# Altium schematic sheet Controller.SchDoc
size A4; SheetNumber: 2; SheetTotal: 5
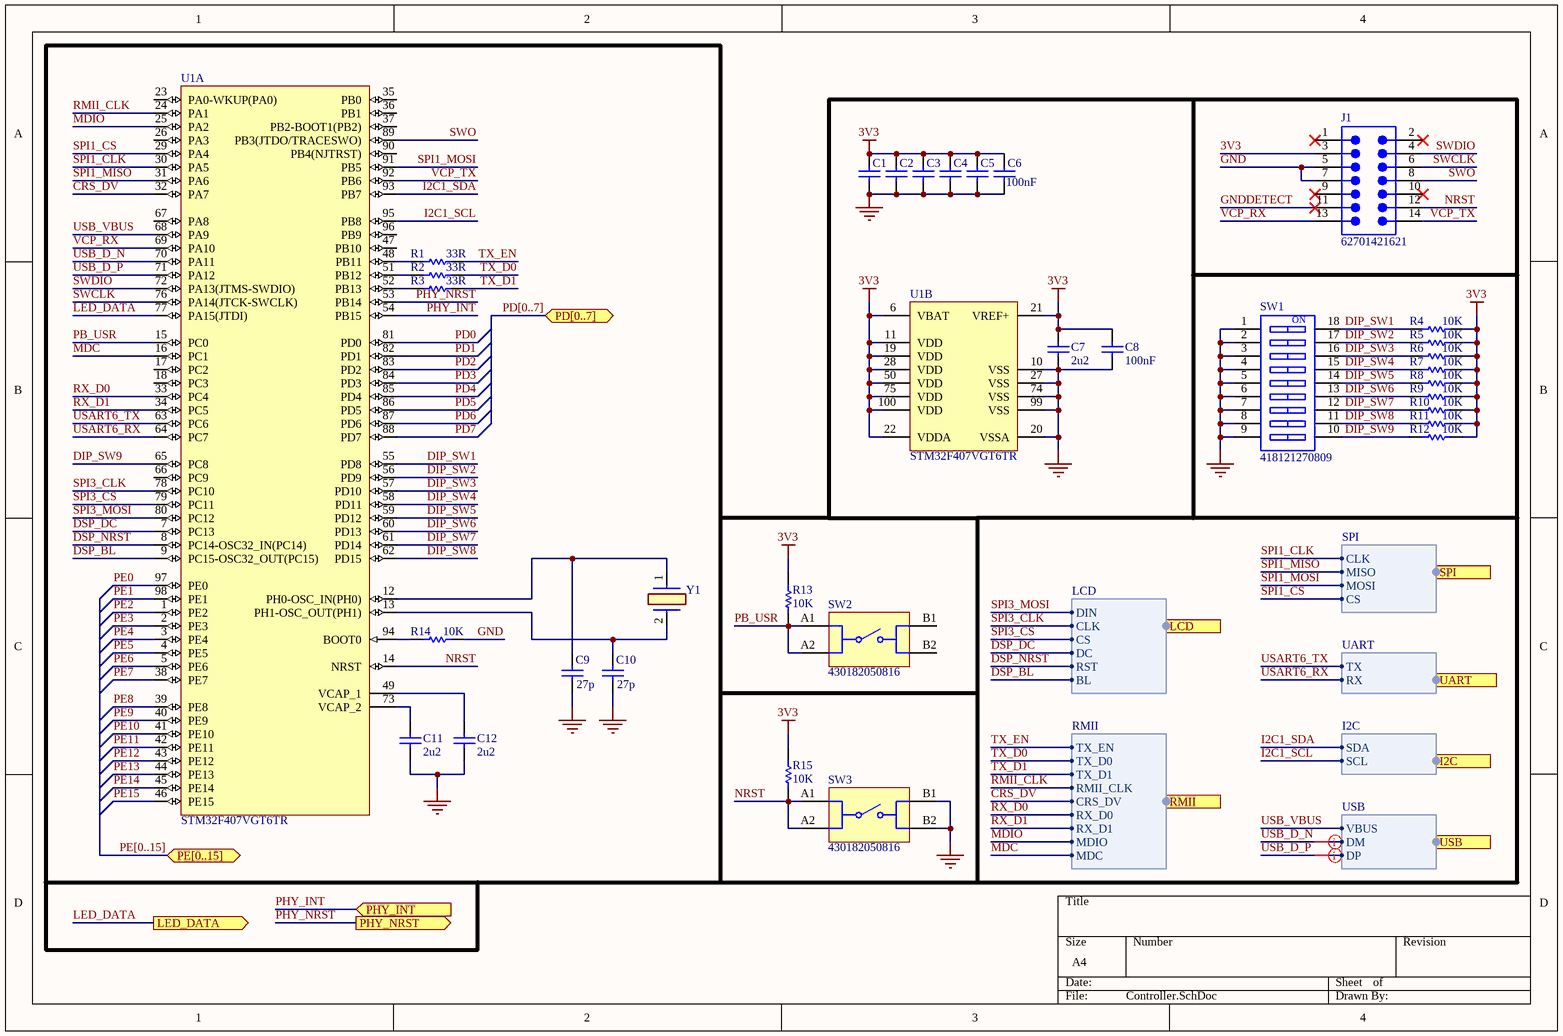
[diagram p0: Controller.SchDoc]

## Parts
C1  100nF  [0603]  (value not drawn)
C2  100nF  [0603]  (value not drawn)
C3  100nF  [0603]  (value not drawn)
C4  100nF  [0603]  (value not drawn)
C5  100nF  [0603]  (value not drawn)
C6  100nF  [0603]
C7  2u2  [1206]
C8  100nF  [0603]
C9  27p  [0603]
C10  27p  [0603]
C11  2u2  [1206]
C12  2u2  [1206]
J1  62701421621  [62701421621]
R1  33R  [0603]
R2  33R  [0603]
R3  33R  [0603]
R4  10K  [0603]
R5  10K  [0603]
R6  10K  [0603]
R7  10K  [0603]
R8  10K  [0603]
R9  10K  [0603]
R10  10K  [0603]
R11  10K  [0603]
R12  10K  [0603]
R13  10K  [0603]
R14  10K  [0603]
R15  10K  [0603]
SW1  418121270809  [418121270809]
SW2  430182050816  [430182050816]
SW3  430182050816  [430182050816]
U1  STM32F407VGT6TR  [STM-LQFP100_V]  (parts A,B of 2)
Y1  ABLS7M-16.000MHZ-B-2-T  [ABLS7]  (value not drawn)

## Ports
I2C (harness I2c, see Main[2B], Periph[4D]), LCD (harness LCD, see Main[2B], Periph[3C]), LED_DATA (out, see Main[2A], Periph[1A]), PD[0..7] (bidir, see Main[2B], Periph[3B]), PE[0..15] (bidir, see Main[2B], Periph[4B]), PHY_INT (in, see Main[2A], Ethernet[1C]), PHY_NRST (out, see Main[2B], Ethernet[1D]), RMII (harness RMII, see Main[2A], Ethernet[1B]), SPI (harness SPI, see Main[2B], Periph[3D]), UART (harness UART, see Main[2B], Periph[4D]), USB (harness USB, see Main[2A], Power[4D])

## Harnesses
RMII: TX_EN, TX_D0, TX_D1, RMII_CLK, CRS_DV, RX_D0, RX_D1, MDIO, MDC
USB: VBUS, DM, DP
I2C: SDA, SCL
UART: TX, RX
SPI: CLK, MISO, MOSI, CS
LCD: DIN, CLK, CS, DC, RST, BL

## Nets
3V3: C1.2 C2.2 C3.2 C4.2 C5.2 C6.2 C7.2 C8.2 J1.3 R4.2 R5.2 R6.2 R7.2 R8.2 R9.2 R10.2 R11.2 R12.2 R13.2 R15.2 U1.6(VBAT) U1.11(VDD) U1.19(VDD) U1.21(VREF+) U1.22(VDDA) U1.28(VDD) U1.50(VDD) U1.75(VDD) U1.100(VDD)
GND: C1.1 C2.1 C3.1 C4.1 C5.1 C6.1 C7.1 C8.1 C9.1 C10.1 C11.1 C12.1 J1.5 J1.7 R14.2 SW1.1 SW1.2 SW1.3 SW1.4 SW1.5 SW1.6 SW1.7 SW1.8 SW1.9 SW3.B1 SW3.B2 U1.10(VSS) U1.20(VSSA) U1.27(VSS) U1.74(VSS) U1.99(VSS)
CRS_DV: U1.32(PA7) ; port RMII.CRS_DV
DIP_SW1: R4.1 SW1.18 U1.55(PD8)
DIP_SW2: R5.1 SW1.17 U1.56(PD9)
DIP_SW3: R6.1 SW1.16 U1.57(PD10)
DIP_SW4: R7.1 SW1.15 U1.58(PD11)
DIP_SW5: R8.1 SW1.14 U1.59(PD12)
DIP_SW6: R9.1 SW1.13 U1.60(PD13)
DIP_SW7: R10.1 SW1.12 U1.61(PD14)
DIP_SW8: R11.1 SW1.11 U1.62(PD15)
DIP_SW9: R12.1 SW1.10 U1.65(PC8)
DSP_BL: U1.9(PC15-OSC32_OUT(PC15)) ; port LCD.BL
DSP_DC: U1.7(PC13) ; port LCD.DC
DSP_NRST: U1.8(PC14-OSC32_IN(PC14)) ; port LCD.RST
GNDDETECT: J1.11
I2C1_SCL: U1.95(PB8) ; port I2C.SCL
I2C1_SDA: U1.93(PB7) ; port I2C.SDA
LED_DATA: U1.77(PA15(JTDI)) ; port LED_DATA
MDC: U1.16(PC1) ; port RMII.MDC
MDIO: U1.25(PA2) ; port RMII.MDIO
NRST: J1.12 R15.1 SW3.A1 SW3.A2 U1.14(NRST)
PB_USR: R13.1 SW2.A1 SW2.A2 U1.15(PC0)
PD0: U1.81(PD0)
PD1: U1.82(PD1)
PD2: U1.83(PD2)
PD3: U1.84(PD3)
PD4: U1.85(PD4)
PD5: U1.86(PD5)
PD6: U1.87(PD6)
PD7: U1.88(PD7)
PE0: U1.97(PE0)
PE1: U1.98(PE1)
PE2: U1.1(PE2)
PE3: U1.2(PE3)
PE4: U1.3(PE4)
PE5: U1.4(PE5)
PE6: U1.5(PE6)
PE7: U1.38(PE7)
PE8: U1.39(PE8)
PE9: U1.40(PE9)
PE10: U1.41(PE10)
PE11: U1.42(PE11)
PE12: U1.43(PE12)
PE13: U1.44(PE13)
PE14: U1.45(PE14)
PE15: U1.46(PE15)
PHY_INT: U1.54(PB15) ; port PHY_INT
PHY_NRST: U1.53(PB14) ; port PHY_NRST
RMII_CLK: U1.24(PA1) ; port RMII.RMII_CLK
RX_D0: U1.33(PC4) ; port RMII.RX_D0
RX_D1: U1.34(PC5) ; port RMII.RX_D1
SPI1_CLK: U1.30(PA5) ; port SPI.CLK
SPI1_CS: U1.29(PA4) ; port SPI.CS
SPI1_MISO: U1.31(PA6) ; port SPI.MISO
SPI1_MOSI: U1.91(PB5) ; port SPI.MOSI
SPI3_CLK: U1.78(PC10) ; port LCD.CLK
SPI3_CS: U1.79(PC11) ; port LCD.CS
SPI3_MOSI: U1.80(PC12) ; port LCD.DIN
SWCLK: J1.6 U1.76(PA14(JTCK-SWCLK))
SWDIO: J1.4 U1.72(PA13(JTMS-SWDIO))
SWO: J1.8 U1.89(PB3(JTDO/TRACESWO))
TX_D0: R2.2 ; port RMII.TX_D0
TX_D1: R3.2 ; port RMII.TX_D1
TX_EN: R1.2 ; port RMII.TX_EN
USART6_RX: U1.64(PC7) ; port UART.RX
USART6_TX: U1.63(PC6) ; port UART.TX
USB_D_N: U1.70(PA11) ; port USB.DM
USB_D_P: U1.71(PA12) ; port USB.DP
USB_VBUS: U1.68(PA9) ; port USB.VBUS
VCP_RX: J1.13 U1.69(PA10)
VCP_TX: J1.14 U1.92(PB6)
NetC9_2: C9.2 U1.12(PH0-OSC_IN(PH0)) Y1.1
NetC10_2: C10.2 U1.13(PH1-OSC_OUT(PH1)) Y1.2
NetC11_2: C11.2 U1.73(VCAP_2)
NetC12_2: C12.2 U1.49(VCAP_1)
NetR1_1: R1.1 U1.48(PB11)
NetR2_1: R2.1 U1.51(PB12)
NetR3_1: R3.1 U1.52(PB13)
NetR14_1: R14.1 U1.94(BOOT0)

Not connected (* = marked no-connect by the designer): J1 1* 2* 9* 10*; SW2 B1 B2; U1 17(PC2) 18(PC3) 23(PA0-WKUP(PA0)) 26(PA3) 35(PB0) 36(PB1) 37(PB2-BOOT1(PB2)) 47(PB10) 66(PC9) 67(PA8) 90(PB4(NJTRST)) 96(PB9)

## Buses and harness runs
bus PD[0..7] = port PD[0..7]
bus PE[0..15] = port PE[0..15]

## Layout directives
differential pair: USB_D_N, USB_D_P

## Notes on the sheet
- (in symbol CMP-1438-00009-2) ON

## Library data of the parts
C1-C6 C8 = C0603C104K1RACAUTO: Capacitor 100V / 0603; Value: 100n
C7 C11 C12 = C1206C225K5RACAUTO7210: Capacitor 50V / 1206; Value: 2.2u
C9 C10 = C0603C270K1HACTU: Capacitor 100V / 0603; Value: 27p
J1 = CMP-03913-122639944-1: 62701421621 Conn, Header, 14Pos, 2Row, 1.27Mm Rohs Compliant: Yes; Insulation Resistance: 1GΩ; Current Rating: 1A; NexarPartId: 122639944; Min Operating Temperature: -40°C; Length: 13.64mm; RoHS: Compliant; Max Operating Temperature: 105°C; Number of Pins: 14; Pitch: 1.27mm
R1-R3 = CRCW060333R0FKEA: Resistor 0.1W; Value: 33R
R4-R15 = CRCW060310K0FKEA: Resistor 0.1W; Value: 10K
SW1 = CMP-1438-00009-2: NexarPartId: 109675040; Current Rating: 25mA; Voltage Rating: 24V; Insulation Resistance: 100MΩ; Max Operating Temperature: 85°C; Packaging: Tape and Reel; Length: 23.8mm; Contact Plating: Gold; Min Operating Temperature: -40°C; RoHS: Compliant
SW2 SW3 = CMP-1452-00014-8: Switch Tactile N.O. SPST Round Button Gull Wing 0.05A 12VDC 1000000Cycles 1.57N SMD Reel; Actuator Material: Liquid Crystal Polymer, Polymer; Switch Function: Off-Mom; Life (Cycles): 1Mcycles; Current Rating: 50mA; Switch Travel: 250µm; Voltage Rating: 12V; Insulation Resistance: 100MΩ; Actuator Length: 1.6mm; Illumination Type: Illuminated, Non-Illuminated; Length: 6.2mm; Height: 5mm; Max Operating Temperature: 85°C; Contact Material: Stainless Steel, Steel; Mount: Surface Mount; Throw Configuration: SPST; Contact Plating: Silver; Lead Free: Lead Free; Width: 6.2mm; Mechanical Life: 1Mcycles; Color: Black; Voltage Rating (DC): 12V; Contact Resistance: 100mΩ; REACH SVHC: No SVHC; Min Operating Temperature: -40°C; Contact Current Rating: 50mA; Termination: Gull Wing; RoHS: Compliant; Packaging: Tape and Reel; Diameter: 3.5mm
U1 = CMP-0243-00033-2: ARM Cortex-M4 32-bit MCU+FPU, 210 DMIPS, 1024 kB Flash, 192 kB Internal RAM, 82 I/Os, 100-pin LQFP, -40 to 85 degC, Tape and Reel; Manufacturer: STMicroelectronics; Supply Voltage(Vcc) max (V): 3.6; Supply Voltage(Vcc) min (V): 1.8; D/A Converter: 2x12-bit; I/Os (High Current): 82; Operating Frequency(F) (Processor speed) (MHz): 168; FLASH Size (Prog) (kB): 1024; Internal RAM Size (kB): 192; ComponentLink1Description: Manufacturer URL; PackageDescription: 100-Pin Low Profile Quad Flat Package, 14 x 14 mm Body, 0.5 mm Pitch; DatasheetVersion: Rev. 4; ComponentLink1URL: http://www.st.com/web/en/home.html; Mounting Technology: Surface Mount; ComponentLink3URL: http://www.st.com/st-web-ui/static/active/en/resource/technical/document/data_brief/DM00071938.pdf; PartNumber: STM32F407VGT6TR; ComponentLink2URL: http://www.st.com/st-web-ui/static/active/en/resource/technical/document/datasheet/DM00037051.pdf; Packing: Tape and Reel; ComponentLink2Description: Datasheet; PackageReference: LQFP100; ComponentLink3Description: Package Specification; PackageVersion: Rev. 1, 06/2013; Core: ARM Cortex-M4
Y1 = ABLS7M-16.000MHZ-B-2-T: Crystal or Oscillator; Manufacturer_Name: ABRACON; Datasheet Link: https://abracon.com/Resonators/ABLS7M.pdf; Height: 2.3mm; Manufacturer_Part_Number: ABLS7M-16.000MHZ-B-2-T; Mouser Part Number: 815-ABLS7M-16-B-2-T; Mouser Price/Stock: https://www.mouser.co.uk/ProductDetail/ABRACON/ABLS7M-16.000MHZ-B-2-T?qs=%252Bk6%2F5FB6qrn1VjId6JGmFw%3D%3D; Arrow Part Number: ABLS7M-16.000MHZ-B-2-T; Arrow Price/Stock: https://www.arrow.com/en/products/abls7m-16.000mhz-b-2-t/abracon?region=nac